# EAGLE schematic parallelDAC (EAGLE 7.4.0)
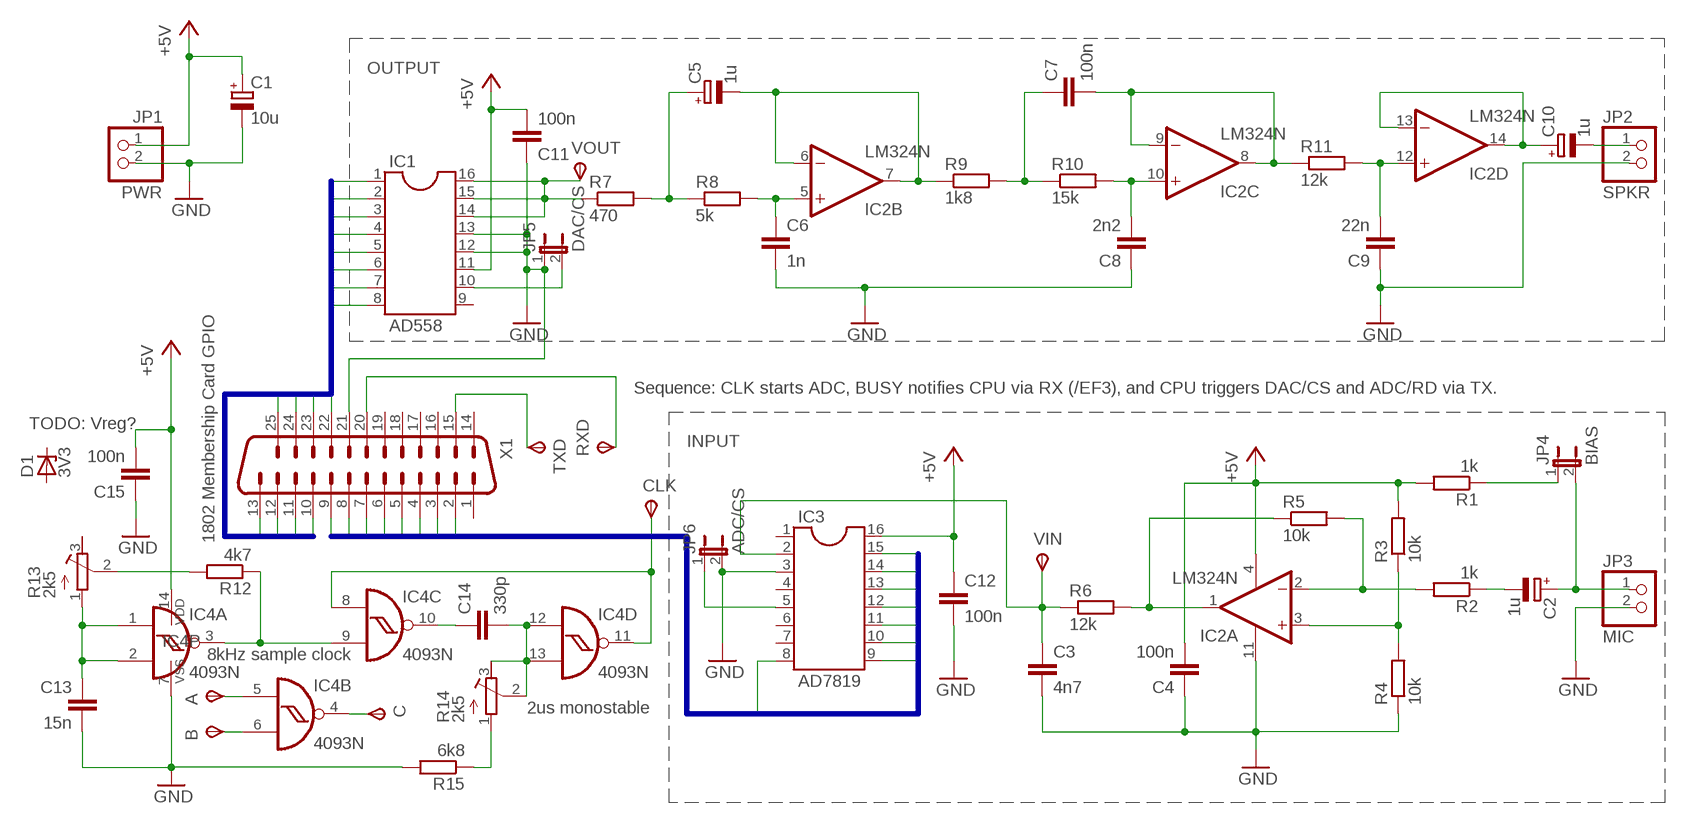
[diagram p0: schematic, sheet 1]

## Parts
A  TPSPAD1-13  [P1-13]
B  TPSPAD1-13  [P1-13]
C  TPSPAD1-13  [P1-13]
C1  10u  CPOL-EUE2.5-5  [E2,5-5]
C2  1u  CPOL-EUE2.5-5  [E2,5-5]
C3  4n7  C-EU025-024X044  [C025-024X044]
C4  100n  C-EU025-024X044  [C025-024X044]
C5  1u  CPOL-EUE2.5-5  [E2,5-5]
C6  1n  C-EU025-024X044  [C025-024X044]
C7  100n  C-EU025-024X044  [C025-024X044]
C8  2n2  C-EU025-024X044  [C025-024X044]
C9  22n  C-EU025-024X044  [C025-024X044]
C10  1u  CPOL-EUE2.5-5  [E2,5-5]
C11  100n  C-EU025-024X044  [C025-024X044]
C12  100n  C-EU025-024X044  [C025-024X044]
C13  15n  C-EU025-024X044  [C025-024X044]
C14  330p  C-EU025-024X044  [C025-024X044]
C15  100n  C-EU025-024X044  [C025-024X044]
CLK  TPSPAD1-13  [P1-13]
D1  3V3  ZENER-DIODEZD-2.5  [ZDIO-2.5]
IC1  AD558  DIL16S  [SOCKET-16]
IC2  LM324N  [DIL14]
IC3  AD7819  DIL16S  [SOCKET-16]
IC4  4093N  [DIL14]
JP1  PWR  PINHD-1X2  [1X02]
JP2  SPKR  PINHD-1X2  [1X02]
JP3  MIC  PINHD-1X2  [1X02]
JP4  BIAS  JP1E  [JP1]
JP5  DAC/CS  JP1E  [JP1]
JP6  ADC/CS  JP1E  [JP1]
R1  1k  R-EU_0207/2V  [0207/2V]
R2  1k  R-EU_0207/2V  [0207/2V]
R3  10k  R-EU_0207/2V  [0207/2V]
R4  10k  R-EU_0207/2V  [0207/2V]
R5  10k  R-EU_0207/2V  [0207/2V]
R6  12k  R-EU_0207/2V  [0207/2V]
R7  470  R-EU_0207/2V  [0207/2V]
R8  5k  R-EU_0207/2V  [0207/2V]
R9  1k8  R-EU_0207/2V  [0207/2V]
R10  15k  R-EU_0207/2V  [0207/2V]
R11  12k  R-EU_0207/2V  [0207/2V]
R12  4k7  R-EU_0207/2V  [0207/2V]
R13  2k5  R-TRIMM64W  [RTRIM64W]
R14  2k5  R-TRIMM64W  [RTRIM64W]
R15  6k8  R-EU_0207/2V  [0207/2V]
RXD  TPSPAD1-13  [P1-13]
TXD  TPSPAD1-13  [P1-13]
VIN  TPSPAD1-13  [P1-13]
VOUT  TPSPAD1-13  [P1-13]
X1  1802 Membership Card GPIO  M25D  [M25D]

## Nets
+5V: C1.+ C4.2 C11.2 C12.1 C15.2 IC1.11 IC2.4(P:V+) IC3.16 IC4.14(P:VDD) JP1.1 R1.2 R3.2
GND: C1.- C3.2 C4.1 C6.2 C8.1 C9.1 C11.1 C12.2 C13.2 C15.1 IC1.12 IC1.13 IC2.11(P:V-) IC3.3 IC4.7(P:VSS) JP1.2 JP2.2 JP3.2 JP5.1 JP6.2 R4.1 R15.2 X1.21
I0: IC3.8 X1.2
I1: IC3.9 X1.3
I2: IC3.10 X1.4
I3: IC3.11 X1.5
I4: IC3.12 X1.6
I5: IC3.13 X1.7
I6: IC3.14 X1.8
I7: IC3.15 X1.9
N$1: C2.+ JP3.1 JP4.2
N$2: C2.- R2.1
N$3: IC2.2(A:-IN) R2.2 R5.2
N$4: IC2.3(A:+IN) R3.1 R4.2
N$5: IC2.1(A:OUT) R5.1 R6.2
N$6: C3.1 IC3.2 R6.1 VIN.TP(PP)
N$7: JP4.1 R1.1
N$8: IC1.14 IC1.15 IC1.16 R7.1 VOUT.TP(PP)
N$9: C5.+ R7.2 R8.1
N$10: C6.1 IC2.5(B:+IN) R8.2
N$11: C5.- IC2.6(B:-IN) IC2.7(B:OUT) R9.1
N$12: C7.1 R9.2 R10.1
N$13: C8.2 IC2.10(C:+IN) R10.2
N$14: C7.2 IC2.8(C:OUT) IC2.9(C:-IN) R11.1
N$15: C9.2 IC2.12(D:+IN) R11.2
N$16: C10.+ IC2.13(D:-IN) IC2.14(D:OUT)
N$17: C13.1 IC4.1(A:I0) IC4.2(A:I1) R13.1(A)
N$18: C10.- JP2.1
N$19: R12.2 R13.2(S)
N$20: A.TP(PP) IC4.5(B:I0)
N$21: C14.2 IC4.12(D:I0) IC4.13(D:I1) R14.2(S) R14.3(E)
N$22: IC4.3(A:O) IC4.9(C:I1) R12.1
N$23: RXD.TP(PP) X1.20
N$24: TXD.TP(PP) X1.15
N$25: IC3.5 JP6.1
N$26: C14.1 IC4.10(C:O)
N$27: CLK.TP(PP) IC4.8(C:I0) IC4.11(D:O)
N$28: IC1.10 JP5.2
N$29: R14.1(A) R15.1
N$30: B.TP(PP) IC4.6(B:I1)
N$31: C.TP(PP) IC4.4(B:O)
O0: IC1.1 X1.25
O1: IC1.2 X1.24
O2: IC1.3 X1.23
O3: IC1.4 X1.22
O4: IC1.5 X1.13
O5: IC1.6 X1.12
O6: IC1.7 X1.11
O7: IC1.8 X1.10
Unconnected: D1.A D1.C IC1.9 IC3.1 IC3.4 IC3.6 IC3.7 R13.3(E) X1.1 X1.14 X1.16 X1.17 X1.18 X1.19

## Buses
I[0..7]
O[0..7]

## Notes on the sheet
- OUTPUT
- Sequence: CLK starts ADC, BUSY notifies CPU via RX (/EF3), and CPU triggers DAC/CS and ADC/RD via TX.
- TODO: Vreg?
- INPUT
- 8kHz sample clock
- 2us monostable

## Library data of the parts
A B C CLK RXD TXD VIN VOUT = testpad:TPS: TEST PIN
C1 C2 C5 C10 = resistor:CPOL-EU: POLARIZED CAPACITOR, European symbol
C3 C4 C6-C9 C11-C15 = resistor:C-EU: CAPACITOR, European symbol
D1 = diode:ZENER-DIODE: Z-Diode
IC1 IC3 = ic-package:DIL16: Dual In Line / Socket
IC2 = linear:LM324: OP AMP
IC4 = 40xx:4093: Quad 2-input NAND schmitt trigger
JP1-JP3 = pinhead:PINHD-1X2: PIN HEADER
JP4-JP6 = jumper:JP1E: JUMPER
R1-R12 R15 = resistor:R-EU_: RESISTOR, European symbol
R13 R14 = rcl:R-TRIMM: Trimm resistor
X1 = con-subd:M25: SUB-D; OC_FARNELL: unknown; OC_NEWARK: unknown